# EAGLE schematic Escorna_CPU_2_10 (EAGLE 6.4)
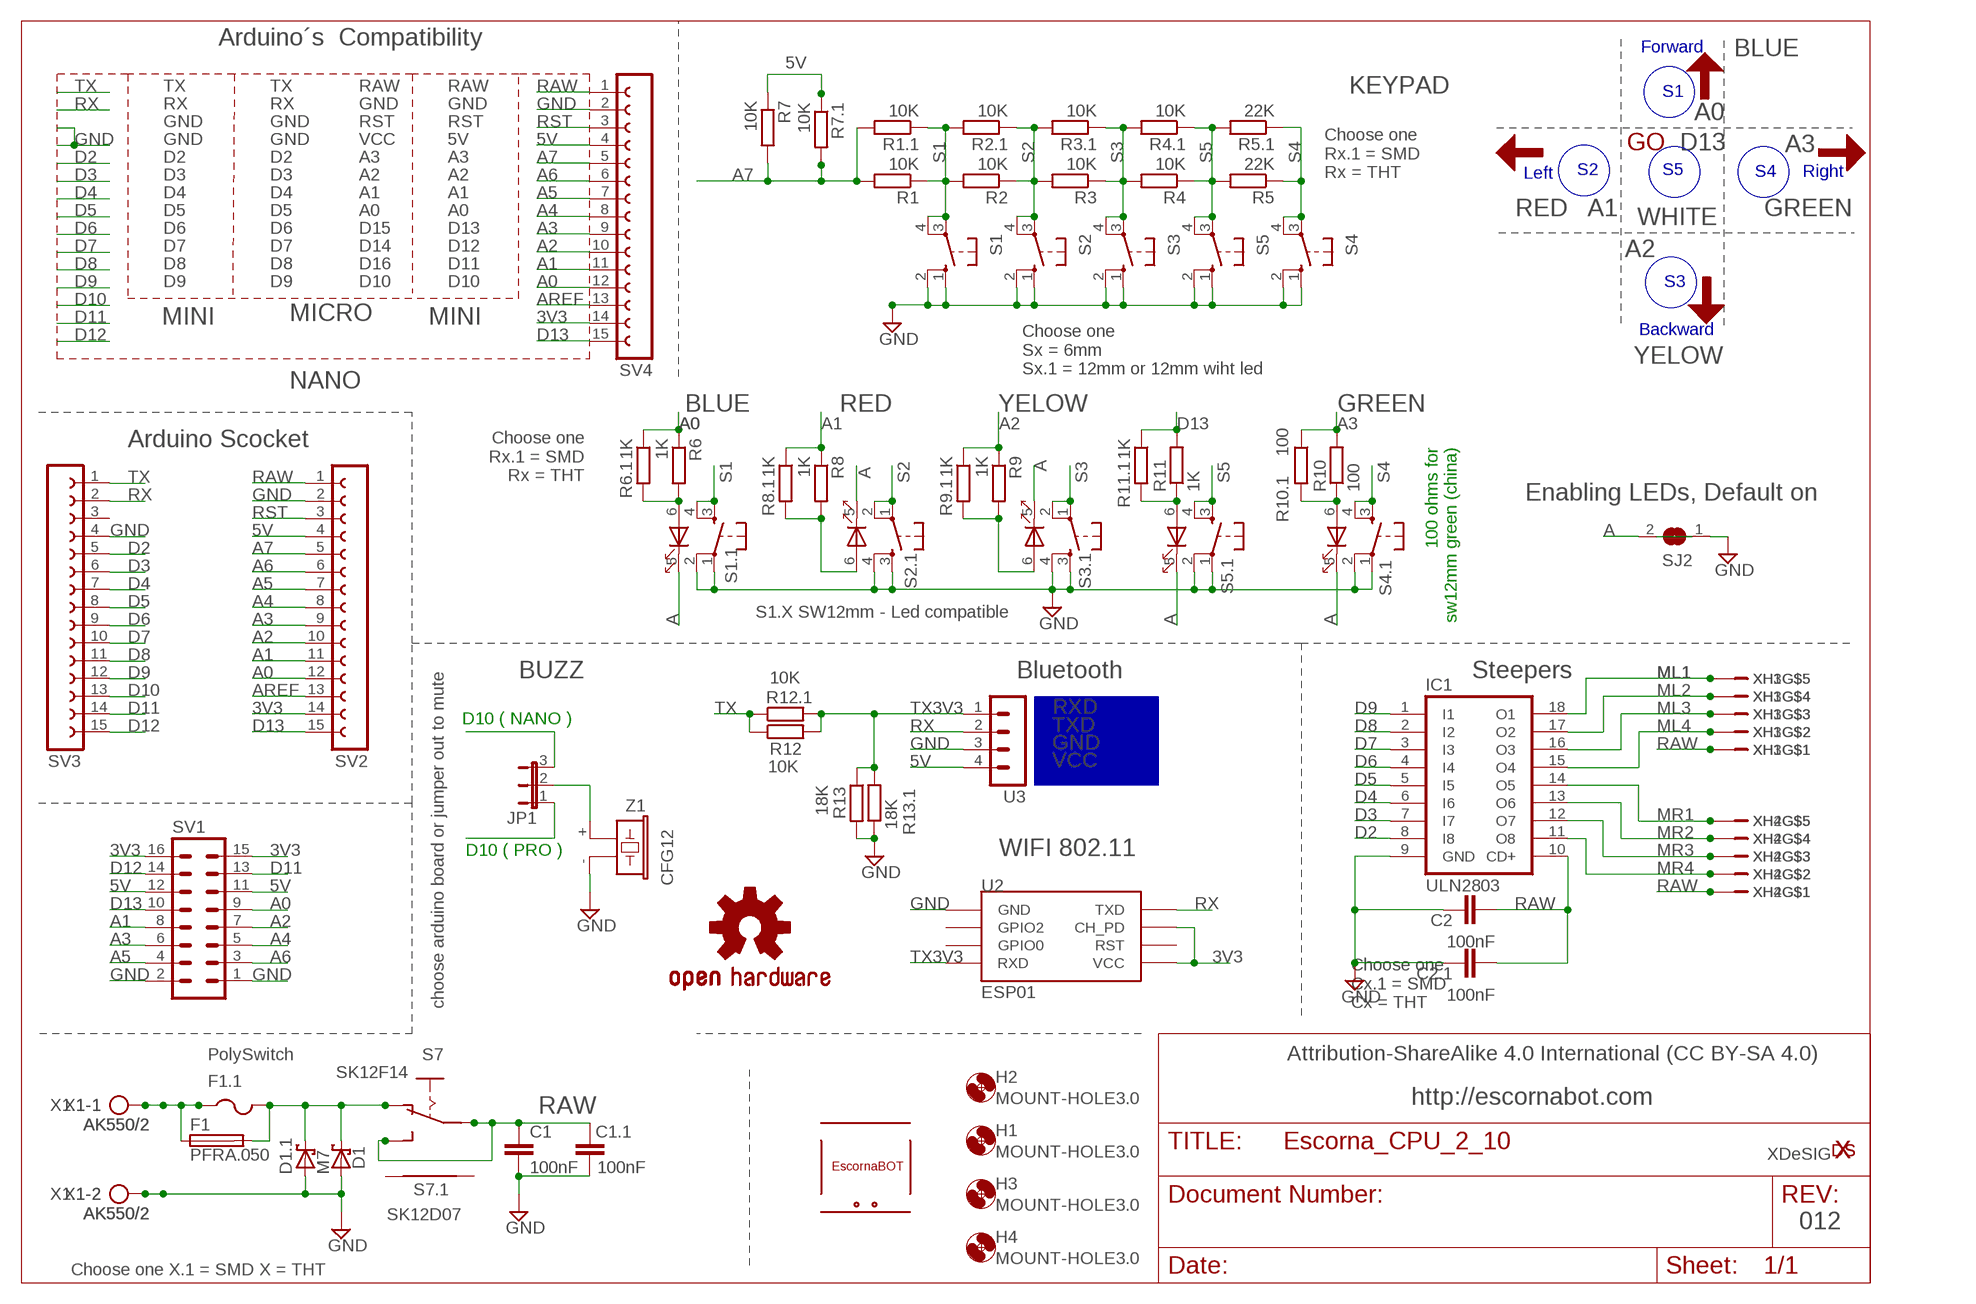
[diagram p0: schematic, sheet 1]

## Parts
C1  100nF  C-EU025-025X050  [C025-025X050]
C1.1  100nF  C-EUC1206  [C1206]
C2  100nF  C-EU025-025X050  [C025-025X050]
C2.1  100nF  C-EUC1206  [C1206]
D1  1N5817  P4KEXX  [DO41-10]
D1.1  M7  SCHOTTKY-DIODESMA  [SMA]
ESC  ESCORNABOT  [ESCORNA_PEQUE]
F1  PFRA.050  FUSETE5  [TE5]
F1.1  PolySwitch  PTCFUSE-1206  [R1206]
H1  MOUNT-HOLE3.0  [3,0]
H2  MOUNT-HOLE3.0  [3,0]
H3  MOUNT-HOLE3.0  [3,0]
H4  MOUNT-HOLE3.0  [3,0]
IC1  ULN2803  ULN2803A  [DIL18]
JP1  JUMPER_JP2E  [JUMPER_JP2]
LOGO2  OSHW-LOGOS  [OSHW-LOGO-S]
R1  10K  R-EU_0204/7  [0204/7]
R1.1  10K  R-EU_R0603  [R0603]
R2  10K  R-EU_0204/7  [0204/7]
R2.1  10K  R-EU_R0603  [R0603]
R3  10K  R-EU_0204/7  [0204/7]
R3.1  10K  R-EU_R0603  [R0603]
R4  10K  R-EU_0204/7  [0204/7]
R4.1  10K  R-EU_R0603  [R0603]
R5  22K  R-EU_0204/7  [0204/7]
R5.1  22K  R-EU_R0603  [R0603]
R6  1K  R-EU_0204/7  [0204/7]
R6.1  1K  R-EU_R0603  [R0603]
R7  10K  R-EU_0204/7  [0204/7]
R7.1  10K  R-EU_R0603  [R0603]
R8  1K  R-EU_0204/7  [0204/7]
R8.1  1K  R-EU_R0603  [R0603]
R9  1K  R-EU_0204/7  [0204/7]
R9.1  1K  R-EU_R0603  [R0603]
R10  100  R-EU_0204/7  [0204/7]
R10.1  100  R-EU_R0603  [R0603]
R11  1K  R-EU_0204/7  [0204/7]
R11.1  1K  R-EU_R0603  [R0603]
R12  10K  R-EU_0204/7  [0204/7]
R12.1  10K  R-EU_R0603  [R0603]
R13  18K  R-EU_0204/7  [0204/7]
R13.1  18K  R-EU_R0603  [R0603]
S1  10-XX  [B3F-10XX]
S1.1  B3F-9XXX  SWITCH-OMRON_B3F-9XXX  [B3F-9XXX]
S2  10-XX  [B3F-10XX]
S2.1  B3F-9XXX  SWITCH-OMRON_B3F-9XXX  [B3F-9XXX]
S3  10-XX  [B3F-10XX]
S3.1  B3F-9XXX  SWITCH-OMRON_B3F-9XXX  [B3F-9XXX]
S4  10-XX  [B3F-10XX]
S4.1  B3F-9XXX  SWITCH-OMRON_B3F-9XXX  [B3F-9XXX]
S5  10-XX  [B3F-10XX]
S5.1  B3F-9XXX  SWITCH-OMRON_B3F-9XXX  [B3F-9XXX]
S7  SK12F14  ESCORNA_SK12F14F  [ESCORNA_SK-12F14-G]
S7.1  SK12D07  ESCORNA_SK12F14D  [ESCORNA_SK-12D07]
SJ2  SJ  [SJ]
SV1  MA08-2  [MA08-2]
SV2  CON-LSTA_FE15-1  [CON-LSTA_FE15]
SV3  CON-LSTA_FE15-1  [CON-LSTA_FE15]
SV4  CON-LSTA_FE15-1  [CON-LSTA_FE15]
U2  ESP01  [ESP01]
U3  MA04-1  [MA04-1]
U$1  FRECHA  [FRECHA]
U$2  GO  [VALE]
U$3  FRECHA  [FRECHA]
U$6  FRECHA  [FRECHA]
U$11  FRECHA  [FRECHA]
U$13  XDESIG_XDESIG21  [XDESIG_XDESIG]
X1  AK550/2  [AK550/2]
X1.1  AK550/2  [AK550/2]
XDS1  XDESIG  [XDESIG_CU_2]
XH1  B5B-XH-A  [B5B-XH-A]
XH2  B5B-XH-A  [B5B-XH-A]
XH3  B5B-XH-A  [B5B-XH-A]
XH4  B5B-XH-A  [B5B-XH-A]
Z1  CFG12  F/CM12P  [F/CM12P]

## Nets
3V3: SV1.15 SV1.16 SV2.14 SV4.14 U2.CH_PD U2.VCC
5V: R7.1 R7.1.1 SV1.11 SV1.12 SV2.4 SV4.4 U3.4
A: S1.1.5(K) S2.1.5(K) S3.1.5(K) S4.1.5(K) S5.1.5(K) SJ2.2
A0: JP1.1 R6.1 R6.1.1 SV1.9 SV2.12 SV4.12
A1: R8.1 R8.1.1 SV1.8 SV2.11 SV4.11
A2: R9.1 R9.1.1 SV1.7 SV2.10 SV4.10
A3: R10.1.1 R10.2 SV1.6 SV2.9 SV4.9
A4: SV1.5 SV2.8 SV4.8
A5: SV1.4 SV2.7 SV4.7
A6: SV1.3 SV2.6 SV4.6
A7: R1.1.2 R1.2 R7.1.2 R7.2 SV2.5 SV4.5
AREF: SV2.13 SV4.13
D2: IC1.8(I8) SV3.5
D3: IC1.7(I7) SV3.6
D4: IC1.6(I6) SV3.7
D5: IC1.5(I5) SV3.8
D6: IC1.4(I4) SV3.9
D7: IC1.3(I3) SV3.10
D8: IC1.2(I2) SV3.11
D9: IC1.1(I1) SV3.12
D10: JP1.3 SV3.13
D11: SV1.13 SV3.14
D12: SV1.14 SV3.15
D13: R11.1.1 R11.2 SV1.10 SV2.15 SV4.15
GND: C1.1.1 C1.2 C2.1 C2.1.1 D1.1.A D1.A IC1.9(GND) R13.1.1 R13.2 S1.1(S) S1.1.1(P) S1.1.2(P1) S1.2(S1) S2.1(S) S2.1.3(S) S2.1.4(S1) S2.2(S1) S3.1(S) S3.1.3(S) S3.1.4(S1) S3.2(S1) S4.1(S) S4.1.1(P) S4.1.2(P1) S4.2(S1) S5.1(S) S5.1.1(P) S5.1.2(P1) S5.2(S1) SJ2.1 SV1.1 SV1.2 SV2.2 SV3.4 SV4.2 U2.GND U3.3 X1.1.2 X1.2 Z1.-
ML1: IC1.18(O1) XH1.P$5 XH3.P$5
ML2: IC1.17(O2) XH1.P$4 XH3.P$4
ML3: IC1.16(O3) XH1.P$3 XH3.P$3
ML4: IC1.15(O4) XH1.P$2 XH3.P$2
MR1: IC1.14(O5) XH2.P$5 XH4.P$5
MR2: IC1.13(O6) XH2.P$4 XH4.P$4
MR3: IC1.12(O7) XH2.P$3 XH4.P$3
MR4: IC1.11(O8) XH2.P$2 XH4.P$2
N$2: JP1.2 Z1.+
N$3: D1.1.C D1.C F1.1.2 F1.2 S7.1.P$2(O) S7.P$2(O)
N$4: R8.1.2 R8.2 S2.1.6(A)
N$5: R6.1.2 R6.2 S1.1.6(A)
N$6: R9.1.2 R9.2 S3.1.6(A)
N$8: R10.1 R10.1.2 S4.1.6(A)
N$10: S7.1.P$4 S7.P$4
N$11: S7.1.P$5 S7.P$5
N$12: F1.1 F1.1.1 X1.1 X1.1.1
N$13: R11.1 R11.1.2 S5.1.6(A)
RAW: C1.1 C1.1.2 C2.1.2 C2.2 IC1.10(CD+) S7.1.P$1(P) S7.1.P$3(S) S7.P$1(P) S7.P$3(S) SV2.1 SV4.1 XH1.P$1 XH2.P$1 XH3.P$1 XH4.P$1
RST: SV2.3 SV4.3
RX: SV3.2 U2.TX(TXD) U3.2
S1: R1.1 R1.1.1 R2.1.2 R2.2 S1.1.3(S) S1.1.4(S1) S1.3(P) S1.4(P1)
S2: R2.1 R2.1.1 R3.1.2 R3.2 S2.1.1(P) S2.1.2(P1) S2.3(P) S2.4(P1)
S3: R3.1 R3.1.1 R4.1.2 R4.2 S3.1.1(P) S3.1.2(P1) S3.3(P) S3.4(P1)
S4: R5.1 R5.1.1 S4.1.3(S) S4.1.4(S1) S4.3(P) S4.4(P1)
S5: R4.1 R4.1.1 R5.1.2 R5.2 S5.1.3(S) S5.1.4(S1) S5.3(P) S5.4(P1)
TX: R12.1 R12.1.1 SV3.1
TX3V3: R12.1.2 R12.2 R13.1 R13.1.2 U2.RX(RXD) U3.1
Unconnected: SV3.3 U2.GPIO0 U2.GPIO2 U2.RST

## Notes on the sheet
- BLUE
- Arduino´s  Compatibility
- Forward
- TX | TX | RAW | RAW | KEYPAD
- S1
- RX | RX | GND | GND
- A0
- GND | GND | RST | RST
- GND | GND | VCC | 5V
- D13 | A3
- D2 | D2 | A3 | A3
- Left | S2 | S5 | S4 | Right
- D3 | D3 | A2 | A2
- Choose one
  Rx.1 = SMD
  Rx = THT
- D4 | D4 | A1 | A1 | RED | GREEN
- D5 | D5 | A0 | A0 | A1
- WHITE
- D6 | D6 | D15 | D13
- D7 | D7 | D14 | D12
- A2
- D8 | D8 | D16 | D11
- D9 | D9 | D10 | D10 | S3
- MINI | MINI
- MICRO
- Backward
- YELOW
- Choose one
  Sx = 6mm
  Sx.1 = 12mm or 12mm wiht led
- NANO | BLUE | RED | YELOW | GREEN
- Choose one
  Rx.1 = SMD
  Rx = THT
- Arduino Scocket
- 100 ohms for
   sw12mm green (china)
- Enabling LEDs, Default on
- S1.X SW12mm - Led compatible
- choose arduino board or jumper out to mute
- BUZZ | Bluetooth | Steepers
- RXD
- D10 ( NANO )
- TXD
- GND
- VCC
- D10 ( PRO ) | WIFI 802.11
- Choose one
  Cx.1 = SMD
  Cx = THT
- Attribution-ShareAlike 4.0 International (CC BY-SA 4.0)
- http://escornabot.com
- XDeSIG
- 012
- Choose one X.1 = SMD X = THT

## Library data of the parts
C1 C1.1 C2 C2.1 = rcl:C-EU: CAPACITOR, European symbol
D1 = diode:P4KEXX: DIODE transient-voltage suppressor
D1.1 = diode:SCHOTTKY-DIODE: Schottky Diode
ESC = escorna:ESCORNABOT
F1 = fuse:FUSE: Fuse; OC_FARNELL: unknown; OC_NEWARK: unknown
F1.1 = adafruit:PTCFUSE: PTC fuses, resettable thermistors
H1-H4 = holes:MOUNT-HOLE: MOUNTING HOLE with drill center marker
IC1 = uln-udn:ULN2803A: DRIVER ARRAY
JP1 = escorna_LBREscorna_CPU_2_10:JUMPER_JP2E: JUMPER
LOGO2 = SparkFun-Aesthetics:OSHW-LOGO: Open Source Hardware Logo This logo indicates the piece of hardware it is found on incorporates a OSHW license and/or adheres to the definition of open source hardware found here: http://freedomdefined.org/OSHW
R1 R1.1 R2 R2.1 R3 R3.1 R4 R4.1 R5 R5.1 R6 R6.1 R7 R7.1 R8 R8.1 R9 R9.1 R10 R10.1 R11 R11.1 R12 R12.1 R13 R13.1 = rcl:R-EU_: RESISTOR, European symbol
S1-S5 = switch-omron:10-XX: OMRON SWITCH; MPN: B3F-1000; OC_FARNELL: 176432; OC_NEWARK: 36M3542
S1.1 S2.1 S3.1 S4.1 S5.1 = Escorna_CPU_2_01:SWITCH-OMRON_B3F-9XXX
S7 S7.1 = escorna_ELIB:ESCORNA_SK12F14
SJ2 = jumper:SJ: SMD solder JUMPER
SV1 = con-lstb:MA08-2: PIN HEADER; OC_FARNELL: unknown; OC_NEWARK: unknown
SV2-SV4 = escorna_LBREscorna_CPU_2_10:CON-LSTA_FE15-1: FEMALE HEADER; OC_FARNELL: unknown; OC_NEWARK: unknown
U2 = esp8266modules:ESP01: ESP8266 Wifi module 01
U3 = con-lstb:MA04-1: PIN HEADER; OC_FARNELL: unknown; OC_NEWARK: unknown
U$1 U$3 U$6 U$11 = escorna:FRECHA
U$2 = escorna:GO
U$13 = Escorna_CPU_2_01:XDESIG_XDESIG
X1 X1.1 = con-ptr500:AK550/2: CONNECTOR; OC_FARNELL: unknown; OC_NEWARK: unknown
XDS1 = xdesig:XDESIG
XH1-XH4 = con-jst:B5B-XH-A
Z1 = buzzer:F/CM12P: BUZZER Source: Buerklin; OC_FARNELL: unknown; OC_NEWARK: unknown

## Net classes
0 default: width 0.254 mm, drill 0.61 mm, clearance 0.254 mm
1 power: width 0.254 mm, drill 0.61 mm, clearance 0.254 mm